# Altium project TDA7850.PrjPcb
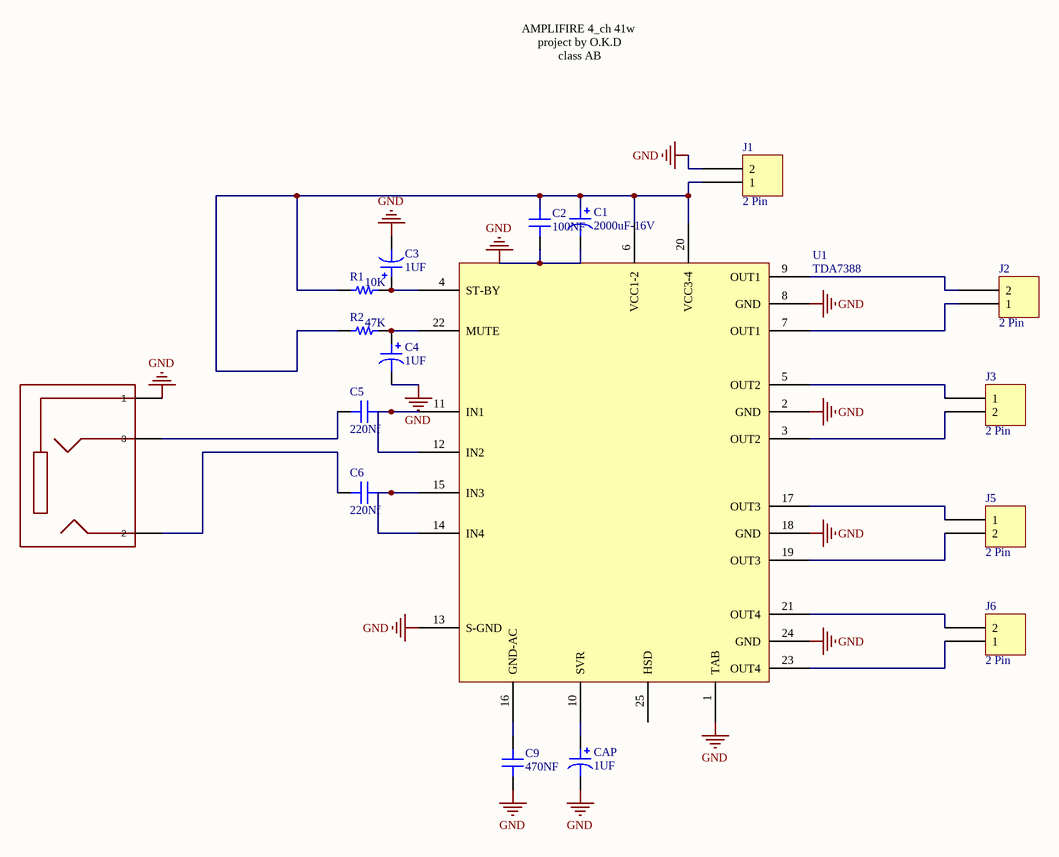
[diagram p0: TDA7850.SchDoc]
1 sheet, 17 parts. Net scope: global (net labels, ports and power ports of the same name join across sheets).
Board file: TDA7850.PcbDoc

## Sheet TDA7850.SchDoc
size A3

### Parts
?  3.5 mm Right-Angle Stereo Jack, 4 Pin PCB Mount, Isolated Ground  [3.5mm jack]  (value not drawn)
C1  2000uF-16V  [Cap_5_(7.5mm)]
C2  100NF  [CAP 1206/3216]
C3  1UF  [CAP ALUM 6.6MM]
C4  1UF  [CAP ALUM 6.6MM]
C5  220Nf  [CAP 1206/3216]
C6  220Nf  [CAP 1206/3216]
C9  470NF  [CAP 1206/3216]
CAP  1UF  [CAP ALUM 6.6MM]
J1  2 Pin  [Socket_Blue_2]
J2  2 Pin  [Socket_Blue_2]
J3  2 Pin  [Socket_Blue_2]
J5  2 Pin  [Socket_Blue_2]
J6  2 Pin  [Socket_Blue_2]
R1  10K  [RES 1206/3216]
R2  47K  [RES 1206/3216]
U1  TDA7388  [TDA7388]

### Nets
GND: ?.1 C1.2 C2.1 C3.2 C4.2 C9.1 CAP.2 J1.2 U1.1(TAB) U1.2(GND) U1.8(GND) U1.13(S-GND) U1.18(GND) U1.24(GND)
Net?_2: ?.2 C6.1
Net?_3: ?.3 C5.1
NetC1_1: C1.1 C2.2 J1.1 R1.1 R2.1 U1.6(VCC1-2) U1.20(VCC3-4)
NetC3_1: C3.1 R1.2 U1.4(ST-BY)
NetC4_1: C4.1 R2.2 U1.22(MUTE)
NetC5_2: C5.2 U1.11(IN1) U1.12(IN2)
NetC6_2: C6.2 U1.14(IN4) U1.15(IN3)
NetC9_2: C9.2 U1.16(GND-AC)
NetCAP_1: CAP.1 U1.10(SVR)
NetJ2_1: J2.1 U1.7(OUT1)
NetJ2_2: J2.2 U1.9(OUT1)
NetJ3_1: J3.1 U1.5(OUT2)
NetJ3_2: J3.2 U1.3(OUT2)
NetJ5_1: J5.1 U1.17(OUT3)
NetJ5_2: J5.2 U1.19(OUT3)
NetJ6_1: J6.1 U1.23(OUT4)
NetJ6_2: J6.2 U1.21(OUT4)

Not connected (* = marked no-connect by the designer): U1 25(HSD)

### Notes on the sheet
- AMPLIFIRE 4_ch 41w
  project by O.K.D
  class AB
- Title
- Size:
- Date:
- A3
- Number:
- Time:
- Revision:
- Sheet
- of
- File:

### Library data of the parts
? = 3.5mm Jack: GateName_1: G$1; SymbolName_1: SJ1-3524NG; MF: CUI; LibraryName: SJ1-3524NG; DeviceSetName: SJ1-3524NG; Package: PIN-4; Price: 0.55 USD; Package: None; MP: SJ1-3524NG; Availability: Good
C1 C3 C4 CAP = Polarised Capacitor: SMT Polarised Capacitor; Value: 10uF
C2 C5 C6 C9 = Capacitor: SMT Capacitor; Value: 0.1uF
R1 R2 = Resistor: SMT Resistor; Value: 1K